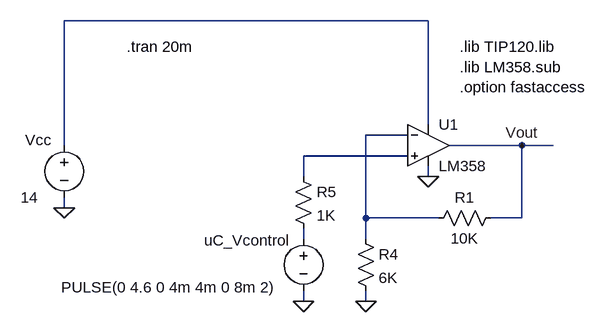
[diagram p0: schematic LM358 Amp.asc]
LM358 Amp.asc, the LTspice schematic file:
Version 4
SHEET 1 1872 740
WIRE 624 -288 64 -288
WIRE 624 -128 624 -288
WIRE 592 -112 528 -112
WIRE 64 -96 64 -288
WIRE 768 -96 656 -96
WIRE 816 -96 768 -96
WIRE 592 -80 432 -80
WIRE 432 -48 432 -80
WIRE 624 -48 624 -64
WIRE 64 0 64 -16
WIRE 528 16 528 -112
WIRE 640 16 528 16
WIRE 768 16 768 -96
WIRE 768 16 720 16
WIRE 432 48 432 32
WIRE 528 48 528 16
WIRE 432 144 432 128
WIRE 528 144 528 128
FLAG 64 0 0
FLAG 768 -96 Vout
FLAG 528 144 0
FLAG 624 -48 0
FLAG 432 144 0
SYMBOL voltage 64 -112 R0
WINDOW 0 -60 8 Left 2
WINDOW 3 -67 96 Left 2
WINDOW 123 0 0 Left 0
WINDOW 39 0 0 Left 0
SYMATTR InstName Vcc
SYMATTR Value 14
SYMBOL OpAmps\\opamp2 624 -160 R0
SYMATTR InstName U1
SYMATTR Value LM358
SYMBOL res 736 0 R90
WINDOW 0 0 56 VBottom 2
WINDOW 3 32 56 VTop 2
SYMATTR InstName R1
SYMATTR Value 10K
SYMBOL res 512 32 R0
SYMATTR InstName R4
SYMATTR Value 6K
SYMBOL res 416 -64 R0
SYMATTR InstName R5
SYMATTR Value 1K
SYMBOL voltage 432 32 R0
WINDOW 0 -153 18 Left 2
WINDOW 3 -373 91 Left 2
WINDOW 123 0 0 Left 2
WINDOW 39 0 0 Left 2
SYMATTR InstName uC_Vcontrol
SYMATTR Value PULSE(0 4.6 0 4m 4m 0 8m 2)
TEXT 160 -248 Left 2 !.tran 20m
TEXT 672 -248 Left 2 !.lib TIP120.lib\n.lib LM358.sub\n.option fastaccess

The netlist it stands for:
* LM358 Amp.asc
Vcc N001 0 14
XU1 N003 N002 N001 0 Vout LM358  ; pins In+ In- V+ V- OUT
R1 Vout N002 10K
R4 N002 0 6K
R5 N003 N004 1K
V§uC_Vcontrol N004 0 PULSE(0 4.6 0 4m 4m 0 8m 2)
.tran 20m
.lib TIP120.lib
.lib LM358.sub
.option fastaccess
.backanno
.end